# EAGLE design untitled (EAGLE 9.5.2)
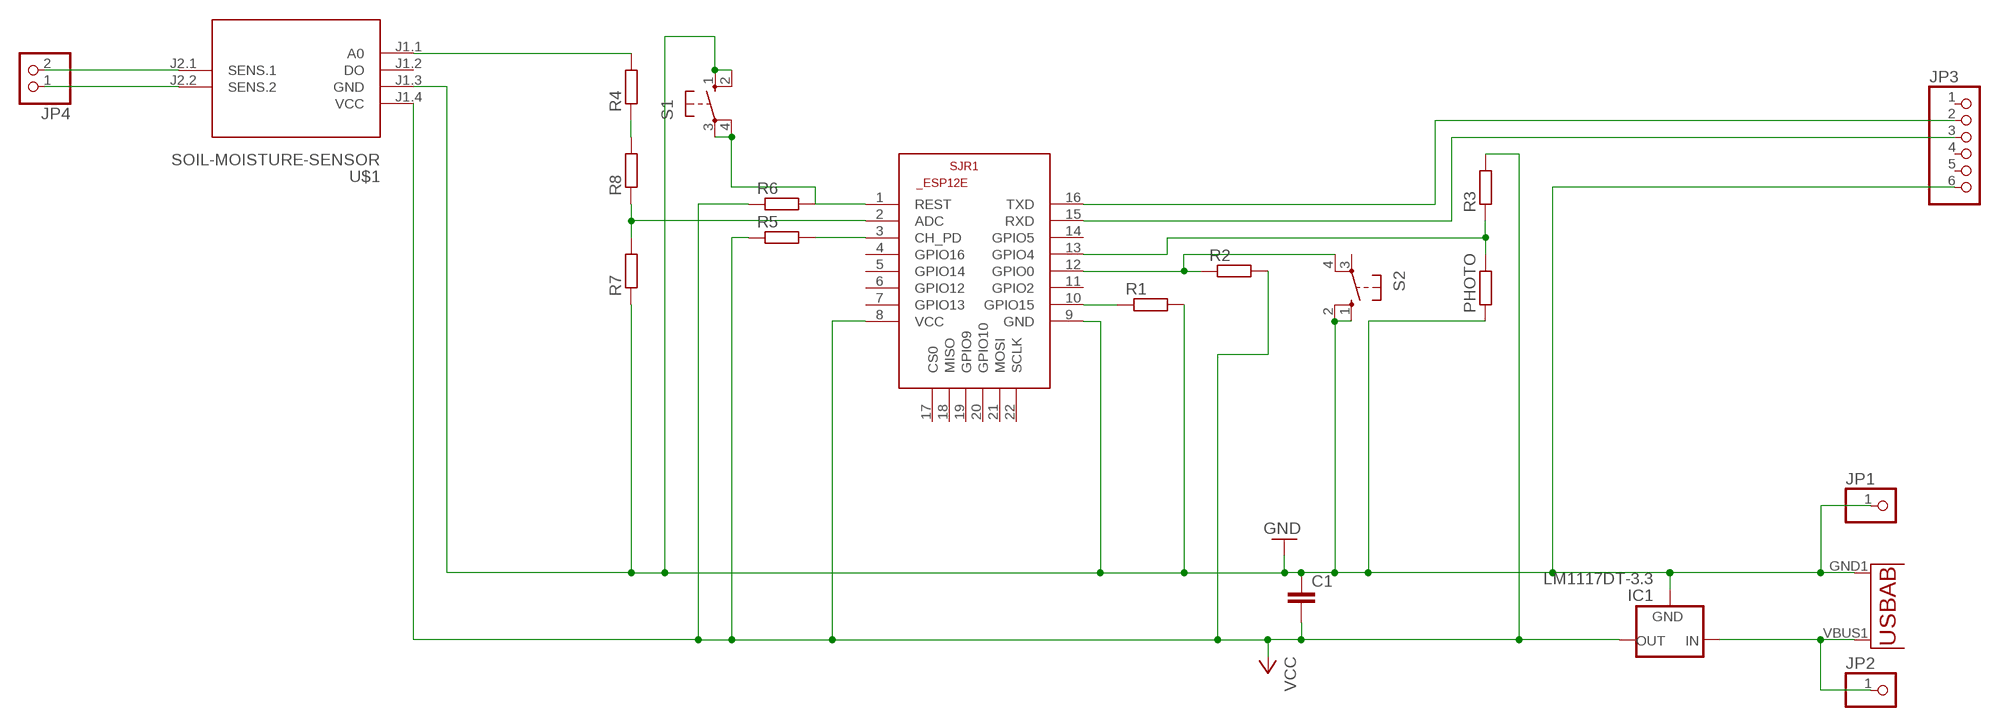
[diagram p0: schematic, sheet 1]

## Parts
C1  C-EU050-025X075  [C050-025X075]
IC1  LM1117DT-3.3  [TO252]
JP1  PINHD-1X1  [1X01]
JP2  PINHD-1X1  [1X01]
JP3  PINHD-1X6  [1X06]
JP4  PINHD-1X2  [1X02]
PHOTO  R-EU_0204/5  [0204/5]
R1  R-EU_0207/10  [0207/10]
R2  R-EU_0207/10  [0207/10]
R3  R-EU_0207/10  [0207/10]
R4  R-EU_0207/10  [0207/10]
R5  R-EU_0207/10  [0207/10]
R6  R-EU_0207/10  [0207/10]
R7  R-EU_0207/10  [0207/10]
R8  R-EU_0207/10  [0207/10]
S1  10-XX  [B3F-10XX]
S2  10-XX  [B3F-10XX]
SJR1  ESP8266-12EESP12E  [ESP8266-ESP12E]
U1  USB""  [USB-MICRO-SMD]
U$1  SOIL-MOISTURE-SENSOR  [SOIL-MOISTURE-SENSOR]

## Nets
GND: C1.1 IC1.1(GND) JP1.1 JP3.6 PHOTO.1 R1.2 R7.1 S1.1(S) S1.2(S1) S2.1(S) S2.2(S1) SJR1.9(GND) U1.GND1(GND) U$1.J1.3(GND)
N$1: IC1.2(IN) JP2.1 U1.VBUS1(VBUS)
N$2: R1.1 SJR1.10(GPIO15)
N$3: R2.1 S2.4(P1) SJR1.12(GPIO0)
N$4: PHOTO.2 R3.1 SJR1.13(GPIO4)
N$5: JP3.3 SJR1.15(RXD)
N$6: JP3.2 SJR1.16(TXD)
N$7: R5.2 SJR1.3(CH_PD)
N$8: R7.2 R8.1 SJR1.2(ADC)
N$9: R4.1 R8.2
N$10: R4.2 U$1.J1.1(A0)
N$11: R6.2 S1.3(P) S1.4(P1) SJR1.1(REST)
N$12: JP4.2 U$1.J2.1(SENS.1)
N$13: JP4.1 U$1.J2.2(SENS.2)
VCC: C1.2 IC1.3(OUT) R2.2 R3.2 R5.1 R6.1 SJR1.8(VCC) U$1.J1.4(VCC)
Unconnected: JP3.1 JP3.4 JP3.5 S2.3(P) SJR1.4(GPIO16) SJR1.5(GPIO14) SJR1.6(GPIO12) SJR1.7(GPIO13) SJR1.11(GPIO2) SJR1.14(GPIO5) SJR1.17(CS0) SJR1.18(MISO) SJR1.19(GPIO9) SJR1.20(GPIO10) SJR1.21(MOSI) SJR1.22(SCLK) U$1.J1.2(DO)

## Library data of the parts
C1 = rcl:C-EU: CAPACITOR, European symbol; SPICEPREFIX: C
IC1 = lm1117_11:LM1117?-*: 800mA Low-Dropout Linear Regulator Source: http://www.ti.com/lit/ds/symlink/lm1117-n.pdf; MF: Texas Instruments; MPN: LM1117DT-3.3; OC_FARNELL: 1469048; OC_NEWARK: 41K3430
JP1 JP2 = adafruit:PINHD-1X1: Pin header 1x1 for 0.1" spacing With round pins
JP3 = adafruit:PINHD-1X6: PIN HEADER
JP4 = pinhead:PINHD-1X2: PIN HEADER
PHOTO R1-R8 = rcl:R-EU_: RESISTOR, European symbol; SPICEPREFIX: R
S1 S2 = switch-omron:10-XX: OMRON SWITCH; MPN: B3F-1000; OC_FARNELL: 176432; OC_NEWARK: 36M3542
SJR1 = esp12e:ESP8266-12E: ESP8266-12E Library for Eagle CAD The author not responsible for any damages or errors!. Created by Suhail jr.lt;/author>
U1 = MicroUSB:USB: This is a USB AB connector that is compatible with USB OTG. i.e. this connector can serve as a host or device
U$1 = diy-modules (1):SOIL-MOISTURE-SENSOR: Soil Moisture Sensor Click here to find device on ebay.com <http://www.ebay.com/sch/soil+moisture+sensor+arduino>

## Board
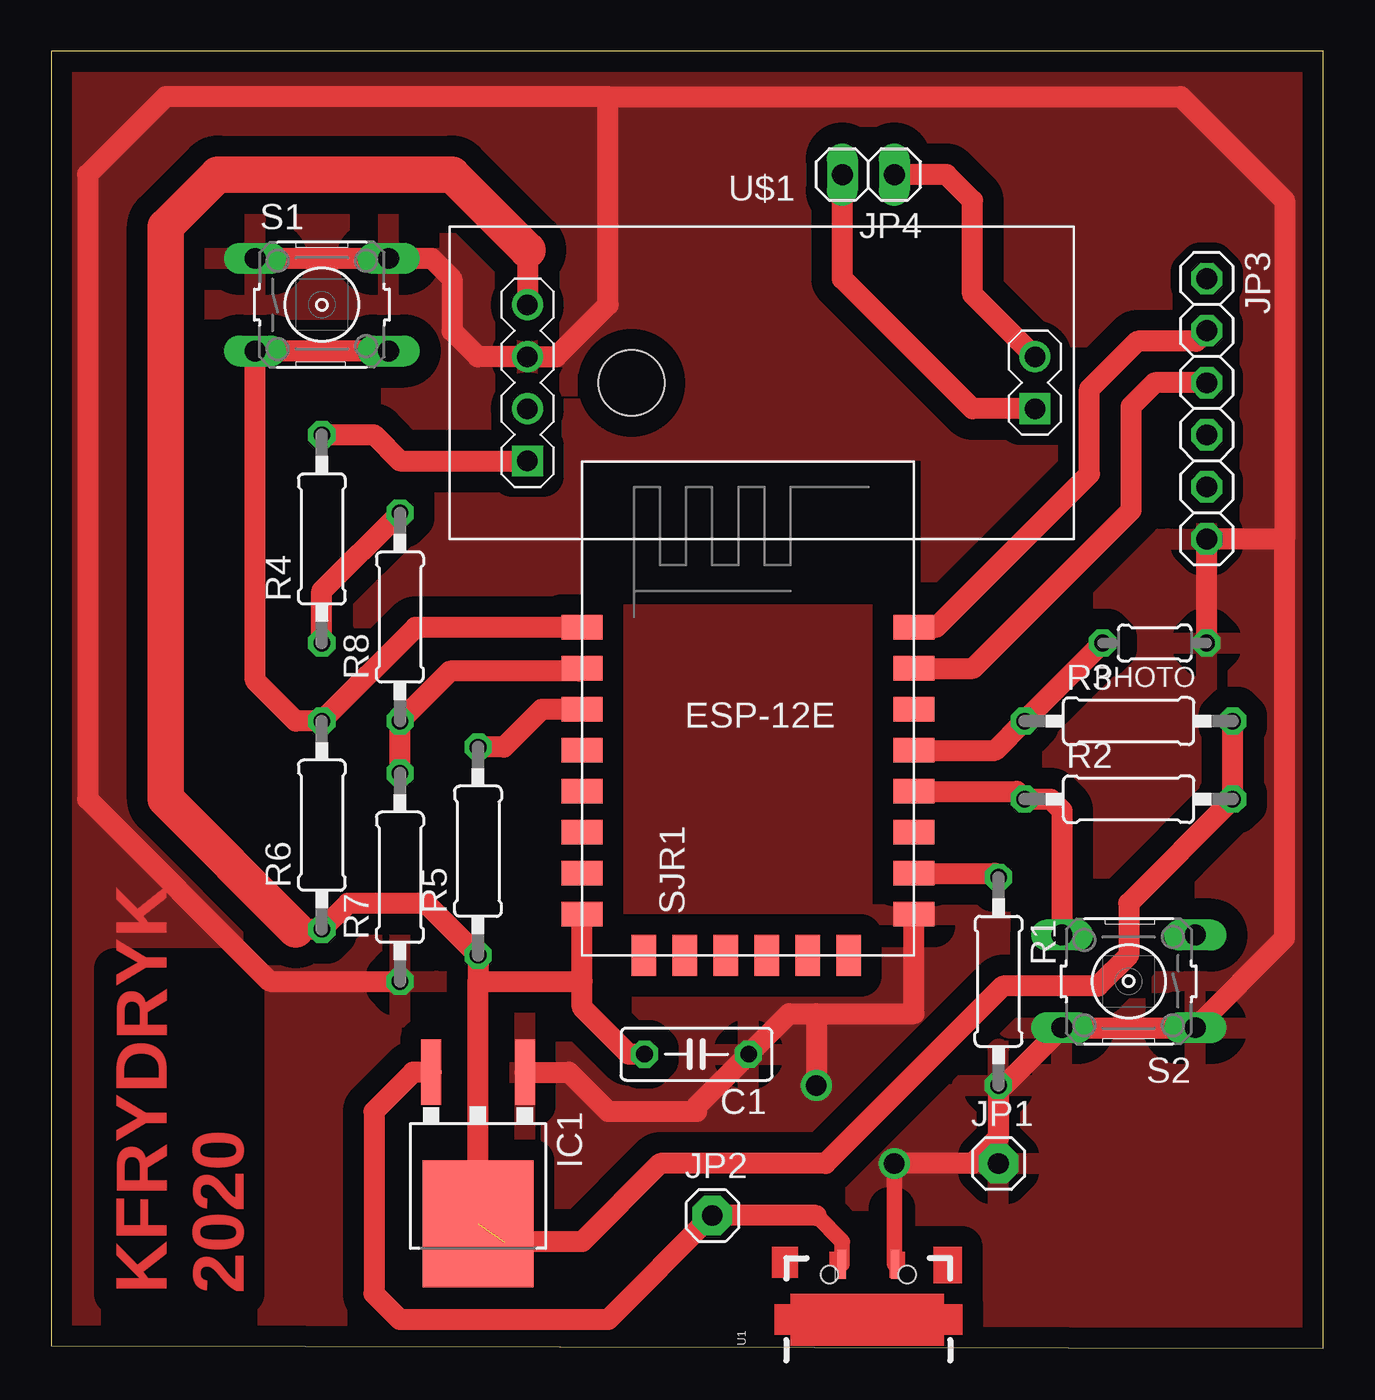
[diagram p1: board, top side]
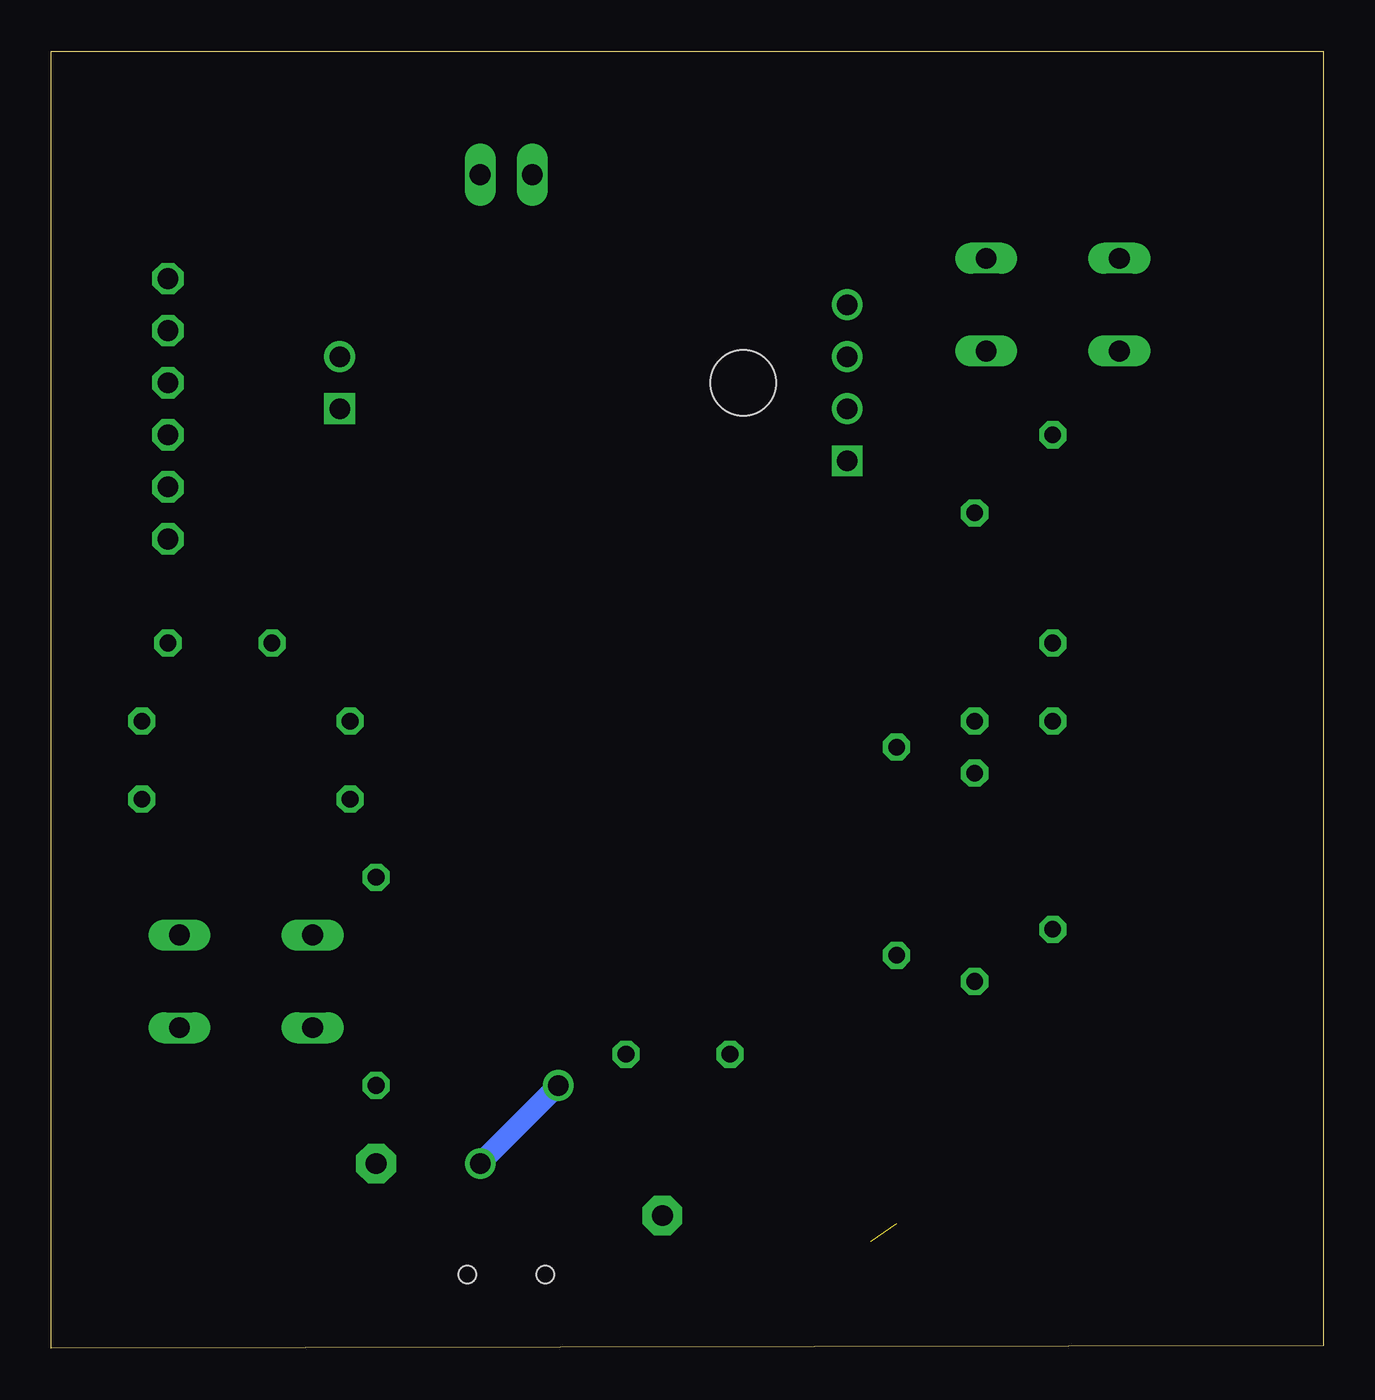
[diagram p2: board, bottom side, seen from below]

Size 62.08 x 63.3 mm. Coordinates in mm from the lower left corner, seen from the top.
Outline: 0,0.13 62.08,0 62.08,63.3 0,63.3 0,0.13
Copper layers (1*16): Top 0.035mm / dielectric 1.5mm / Bottom 0.035mm
Design rules "default *": minimum track width 30mil, minimum drill 0.35mm, track to track 40mil, track to pad 30mil, pad to pad 30mil, via to via 30mil, smd to smd 40mil, copper to edge 40mil, drill to drill 30mil, minimum pad ring 10mil, minimum via ring 8mil, stop-mask expansion 4mil, vias tented up to drill 0mil, thermal gap 40mil

### Footprints (pad centres in the part's own frame; a part is rotated, then mirrored left to right if it is on the bottom)
C050-025X075 = drill 0.813 octagon: 1 -2.54,0; 2 2.54,0
TO252 = smd 0.97 x 3.2: 1 -2.29,-4.45; 2 2.29,-4.45 | smd 5.4 x 6.2: 3 0,2.95
1X01 = drill 1.016 pad 1.93 octagon: 1 0,0
1X06 = drill 1.016 octagon: 1 -6.35,0; 2 -3.81,0; 3 -1.27,0; 4 1.27,0; 5 3.81,0; 6 6.35,0
1X02 = drill 1.016 long: 1 -1.27,0; 2 1.27,0
0204/5 = drill 0.813 octagon: 1 -2.54,0; 2 2.54,0
0207/10 = drill 0.813 octagon: 1 -5.08,0; 2 5.08,0
B3F-10XX = drill 1.016 long: 1 -3.251,2.261; 2 3.251,2.261; 3 -3.251,-2.261; 4 3.251,-2.261
ESP8266-ESP12E = smd 2 x 1.2: 1 -7.62,5.84; 2 -7.62,3.84; 3 -7.62,1.84; 4 -7.62,-0.16; 5 -7.62,-2.16; 6 -7.62,-4.16; 7 -7.62,-6.16; 8 -7.62,-8.16; 9 8.58,-8.16; 10 8.58,-6.16; 11 8.58,-4.16; 12 8.58,-2.16; 13 8.58,-0.16; 14 8.58,1.84; 15 8.58,3.84; 16 8.58,5.84 | smd 1.2 x 2: 17 -4.62,-10.16; 18 -2.62,-10.16; 19 -0.62,-10.16; 20 1.38,-10.16; 21 3.38,-10.16; 22 5.38,-10.16
USB-MICRO-SMD = smd 1.4 x 0.4: GND1 2.7,-1.3; VBUS1 2.7,1.3 | hole 0.85: 2.2,1.9; 2.2,-1.9
SOIL-MOISTURE-SENSOR = drill 1 square: J1.1 -11.43,-3.81; J2.1 13.335,-1.27 | drill 1: J1.2 -11.43,-1.27; J1.3 -11.43,1.27; J1.4 -11.43,3.81; J2.2 13.335,1.27 | hole 3.2: -6.35,0

### Placement (x,y rotation side)
C1  31.5,14.35 180 top
IC1  20.83,9.02 180 top
JP1  46.23,9.02 0 top
JP2  32.26,6.48 0 top
JP3  56.39,45.85 270 top
JP4  39.88,57.28 180 top
PHOTO  53.85,34.42 180 top
R1  46.23,17.91 270 top
R2  52.58,26.8 0 top
R3  52.58,30.61 0 top
R4  13.21,39.5 90 top
R5  20.83,24.26 90 top
R6  13.21,25.53 90 top
R7  17.02,22.99 90 top
R8  17.02,35.69 90 top
S1  13.21,50.93 0 top
S2  52.58,17.91 180 top
SJR1  33.53,29.34 0 top
U1  39.88,1.4 90 top
U$1  34.67,47.12 0 top

### Tracks (layer width: path | path; a pad name or v marks a point on that pad's centre or on a via)
GND  (via drill 1)
  Top 0.762: U1.GND1 41.15,4.13 v41.15,9.02
  Top 1.016: SJR1.9 42.11,16.33 37.34,16.33 | 50.32,15.65 S2.2 | S2.2 46.51,12.83 R1.2 46.23,10.29 44.96,9.02 v41.15,9.02 | S1.1 S1.2 18.57,53.19 19.56,52.2 19.56,49.66 20.83,48.39 U$1.J1.3 24.64,48.39 27.18,50.93 27.18,61.09 | IC1.1 25.27,13.47 27.18,11.56 31.5,11.56 31.5,11.81 C1.1 36.01,16.33 37.34,16.33 | PHOTO.1 JP3.6 60.2,39.5 | 27.18,61.09 5.59,61.09 1.78,57.28 1.78,26.8 10.67,17.91 R7.1 | 27.18,61.09 55.12,61.09 60.2,56.01 60.2,39.5 | 60.2,39.5 60.2,20.01 S2.1 S2.2 | 37.34,16.33 v37.34,12.83
  Bottom 1.016: v37.34,12.83 v41.15,9.02
  pour Top: 0,63.63 0,0.13 61.98,0.13 61.98,63.63
N$1
  Top 0.762: U1.VBUS1 38.58,5.18 38.61,5.21 37.34,6.48
  Top 1.016: IC1.2 17.66,13.47 15.75,11.56 15.75,2.67 17.02,1.4 27.18,1.4 JP2.1 37.34,6.48
N$2
  Top 1.016: SJR1.10 46.04,23.18 R1.1
N$3
  Top 1.016: SJR1.12 47.12,27.18 R2.1 48.77,26.8 49.33,26.24 S2.4
N$4
  Top 1.016: SJR1.13 46.07,29.18 R3.1 PHOTO.2
N$5
  Top 1.016: JP3.3 53.85,47.12 52.71,45.97 52.71,40.89 44.99,33.18 SJR1.15
N$6
  Top 1.016: SJR1.16 43.18,35.18 50.67,42.67 50.67,46.82 53.01,49.15 55.88,49.15 JP3.2
N$7
  Top 1.016: SJR1.3 23.94,31.18 22.1,29.34 R5.2
N$8
  Top 1.016: SJR1.2 25.78,33.05 19.46,33.05 R8.1 R7.2
N$9
  Top 1.016: R4.1 13.21,36.96 R8.2
N$10
  Top 1.016: R4.2 15.75,44.58 17.02,43.31 U$1.J1.1
N$11
  Top 1.016: S1.4 S1.3 9.96,32.59 11.94,30.61 R6.2 17.78,35.18 SJR1.1
N$12
  Top 1.016: U$1.J2.1 44.96,45.85 38.61,52.2 JP4.2
N$13
  Top 1.016: U$1.J2.2 44.96,51.44 44.96,56.01 43.69,57.28 JP4.1
VCC  (1 unrouted)
  Top 1.016: C1.2 28.19,14.35 25.91,16.64 25.91,17.91 | 25.91,17.91 SJR1.8 | R3.2 R2.2 52.58,21.72 52.58,19.18 51.08,17.68 46.45,17.68 37.79,9.02 29.72,9.02 25.91,5.21 22.1,5.21 | 11.94,20.45 R6.1 14.48,21.72 18.29,21.72 R5.1 20.83,17.91 | U$1.J1.4 23.24,53.59 22.1,54.74 | IC1.3 20.83,17.91 | 20.83,17.91 25.91,17.91
  Top 1.778: 11.94,20.45 5.59,26.8 5.59,54.74 8.13,57.28 19.56,57.28 23.24,53.59
(copper drawn outside any net)
  shapes: Top area x6

### Text on the board
Top: KFRYDRYK / 2020